# Altium schematic sheet LiDAR_Schematic.SchDoc
size A4; SheetNumber: 1; SheetTotal: 1
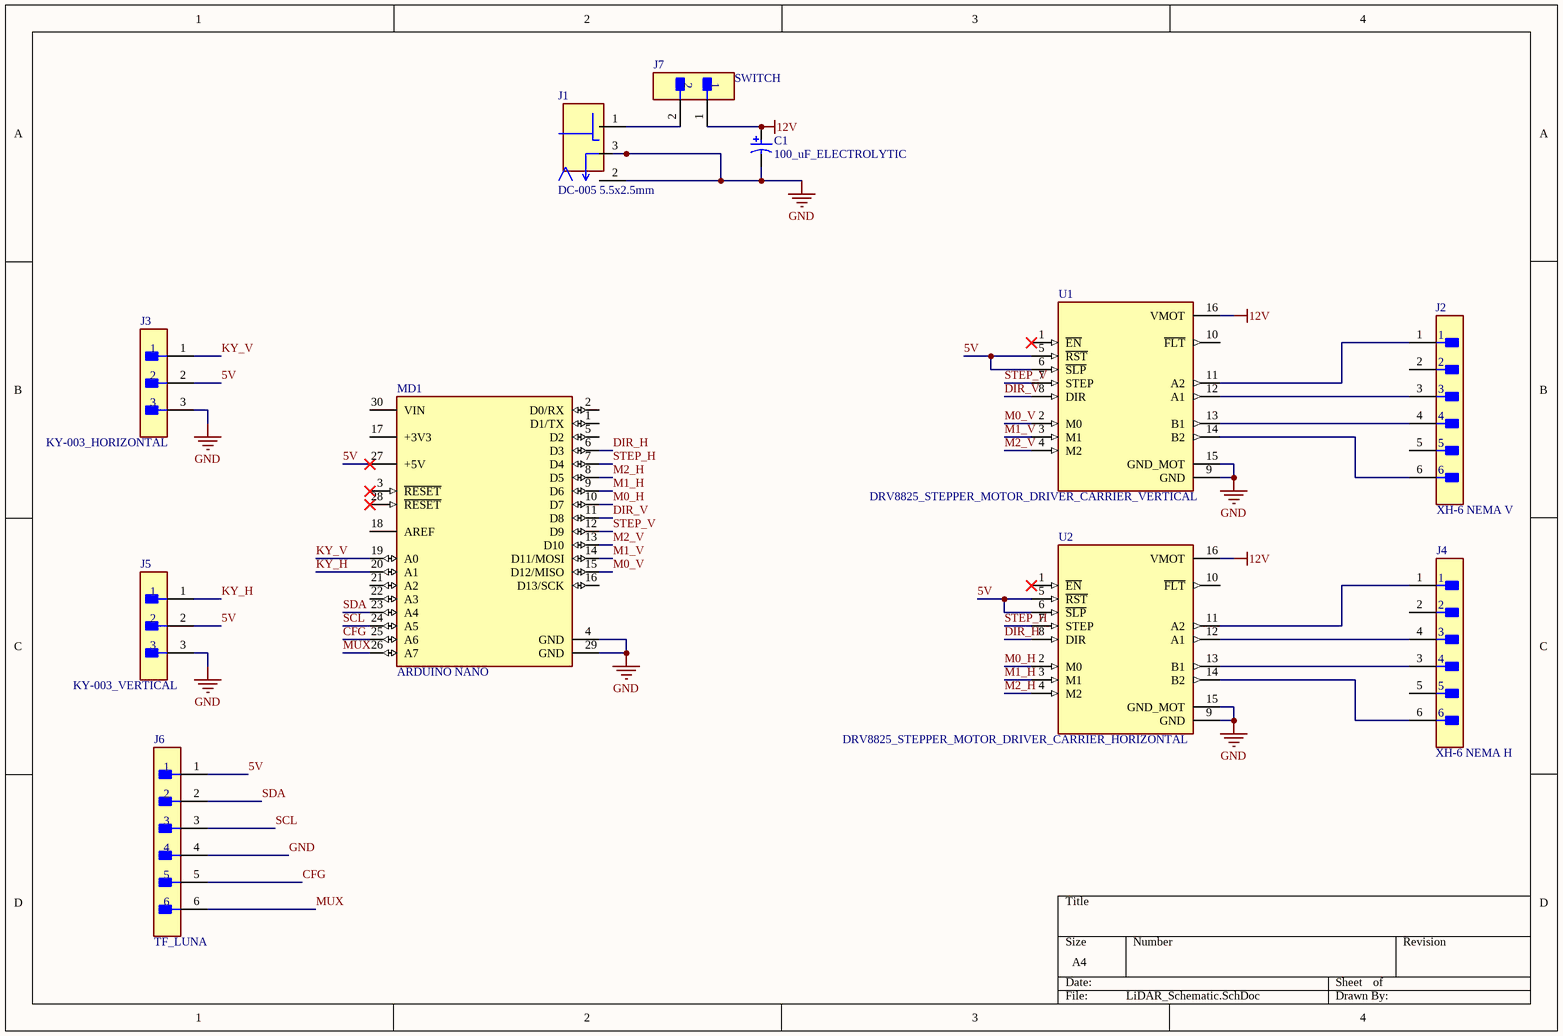
[diagram p0: LiDAR_Schematic.SchDoc]

## Parts
C1  100_uF_ELECTROLYTIC  [CAPPR55-250-1120X630X1220]
J1  DC-005 5.5x2.5mm  [GCT_DCJ250-10-A-XX-X_REVA]
J2  XH-6 NEMA V  [FP-B6B-XH-A_LF_SN-MFG]
J3  KY-003_HORIZONTAL  [FP-87224-3-MFG]
J4  XH-6 NEMA H  [FP-B6B-XH-A_LF_SN-MFG]
J5  KY-003_VERTICAL  [FP-87224-3-MFG]
J6  TF_LUNA  [FP-22-28-4060-MFG]
J7  SWITCH  [FP-TSW-102-07-S-S-MFG]
MD1  ARDUINO NANO  [FP-A000005-MFG]
U1  DRV8825_STEPPER_MOTOR_DRIVER_CARRIER_VERTICAL  [IC_DRV8825_STEPPER_MOTOR_DRIVER_CARRIER]
U2  DRV8825_STEPPER_MOTOR_DRIVER_CARRIER_HORIZONTAL  [IC_DRV8825_STEPPER_MOTOR_DRIVER_CARRIER]

## Nets
12V: C1.1 J7.1 U1.16(VMOT) U2.16(VMOT)
GND: C1.2 J1.2(TIP) J1.3(SHUNT) J3.3 J5.3 J6.4 MD1.4(GND) MD1.29(GND) U1.9(GND) U1.15(GND_MOT) U2.9(GND) U2.15(GND_MOT)
5V: J3.2 J5.2 J6.1 MD1.27(+5V) U1.5(~{RST}) U1.6(~{SLP}) U2.5(~{RST}) U2.6(~{SLP})
CFG: J6.5 MD1.25(A6)
DIR_H: MD1.6(D3) U2.8(DIR)
DIR_V: MD1.11(D8) U1.8(DIR)
KY_H: J5.1 MD1.20(A1)
KY_V: J3.1 MD1.19(A0)
M0_H: MD1.10(D7) U2.2(M0)
M0_V: MD1.15(D12/MISO) U1.2(M0)
M1_H: MD1.9(D6) U2.3(M1)
M1_V: MD1.14(D11/MOSI) U1.3(M1)
M2_H: MD1.8(D5) U2.4(M2)
M2_V: MD1.13(D10) U1.4(M2)
MUX: J6.6 MD1.26(A7)
SCL: J6.3 MD1.24(A5)
SDA: J6.2 MD1.23(A4)
STEP_H: MD1.7(D4) U2.7(STEP)
STEP_V: MD1.12(D9) U1.7(STEP)
NetJ1_1: J1.1(CENTER) J7.2
NetJ2_1: J2.1 U1.11(A2)
NetJ2_3: J2.3 U1.12(A1)
NetJ2_4: J2.4 U1.13(B1)
NetJ2_6: J2.6 U1.14(B2)
NetJ4_1: J4.1 U2.11(A2)
NetJ4_3: J4.3 U2.13(B1)
NetJ4_4: J4.4 U2.12(A1)
NetJ4_6: J4.6 U2.14(B2)

Not connected (* = marked no-connect by the designer): J2 2 5; J4 2 5; MD1 1(D1/TX) 2(D0/RX) 3(~{RESET})* 5(D2) 16(D13/SCK) 17(+3V3) 18(AREF) 21(A2) 22(A3) 28(~{RESET})* 30(VIN); U1 1(~{EN})* 10(~{FLT}); U2 1(~{EN})* 10(~{FLT})

## Library data of the parts
C1 = CMP-1665-00015-4: Aluminum Electrolytic Capacitor (Radial Lead Type), 100 uF, 35 V, -40 to 85 degC, 2-Pin THD, RoHS, Bulk; Manufacturer: Panasonic; Voltage Rating: 35 V; PackageReference: Radial; ComponentLink2URL: http://industrial.panasonic.com/cdbs/www-data/pdf/RDF0000/ABA0000C1047.pdf; DatasheetVersion: 03/2016; REACH SVHC: No SVHC; Mounting Technology: Through Hole; ComponentLink2Description: Datasheet; Packaging: Bulk; Lead Pitch: 2.5 mm; Height: 11.2 mm; Pins: 2; RoHSCompliant: true; Mount: Through Hole; Package Quantity: 200; Min Operating Temperature: -40 degC; Max Operating Temperature: 85 degC; PackageDescription: 2-Pin Through Hole Device, Dia 6.3 mm, Body Length 11.2 mm; ComponentLink1Description: Manufacturer URL; Length: 11.2 mm; ComponentLink1URL: http://www.panasonic.com/
J1 = DCJ250-10-A-XX-X_REVA: Power Barrel Connector Jack 2.55mm ID (0.100), 5.50mm OD (0.217) Through Hole, Right Angle; MP: DCJ250-10-A-K1-K; MF: Global Connector Technology; Package: None; Check_prices: https://www.snapeda.com/parts/DCJ250-10-A-K1-K/Global+Connector+Technology/view-part/?ref=eda; Purchase-URL: https://pricing.snapeda.com/search/part/DCJ250-10-A-K1-K/?ref=eda; Value: *; Availability: In Stock; Price: None; SnapEDA_Link: https://www.snapeda.com/parts/DCJ250-10-A-K1-K/Global+Connector+Technology/view-part/?ref=snap
J2 J4 = CMP-17439-000076-1: CONN HEADER VERT 6POS 2.5MM
J3 = CMP-2000-05697-2: CONN HEADER VERT 3POS 2.54MM; Number of Positions: 3; Gasket: No (Without); High Speed Serial Data Connector: No; Current Rating: 3A; Contact Post Length: 0.125inch; PCB Thickness: 1.397mm; PCB Mount Retention: Without; Connector Type: Plug; Approvals: CSA; PCB Mounting Orientation: Vertical; Pitch: 2.54mm; Mating Alignment: No (Without); Housing Color: Black; Contact Gender: Male; Length: 7.21mm; Max Operating Temperature: 105°C; Strain Relief: No (Without); Contact Material: Bronze; Row Spacing: 2.54mm; Series: AMPMODU MOD II; Board Standoff: No (Without); Package Quantity: 520; Radiation Hardening: No; Contact Protection: No (Without); Stabilizers: No (Without); Number of Rows: 1; Contact Mating Length: 8.08mm; Contact Shape: Square; Depth: 2.54mm; Contact Current Rating: 3A; Flammability Rating: UL94 V-0; Packaging: Carton; Number of Contacts: 3; Orientation: Straight; Mount: Through Hole; Keyed: No; Contact Type: Male Pin; Housing Material: Thermoplastic; High Temperature Housing: No; ELV: Compliant; Contact Plating: Gold; Termination: Through Hole; Selectively Loaded: No (Without); Lead Free: Lead Free; Min Operating Temperature: -65°C; Mating Connector Lock: No (Without); Color: Black; RoHS Compliant: Yes
J5 = CMP-2000-05697-2: CONN HEADER VERT 3POS 2.54MM; Number of Positions: 3; Gasket: No (Without); High Speed Serial Data Connector: No; Current Rating: 3A; Contact Post Length: 0.125inch; PCB Thickness: 1.397mm; PCB Mount Retention: Without; Connector Type: Plug; Approvals: CSA; Pitch: 2.54mm; Mating Alignment: No (Without); Housing Color: Black; Contact Gender: Male; Length: 7.21mm; Max Operating Temperature: 105°C; Strain Relief: No (Without); Contact Material: Bronze; Row Spacing: 2.54mm; Series: AMPMODU MOD II; Board Standoff: No (Without); Package Quantity: 520; Radiation Hardening: No; Contact Protection: No (Without); Stabilizers: No (Without); Number of Rows: 1; Contact Mating Length: 8.08mm; Contact Shape: Square; Depth: 2.54mm; Contact Current Rating: 3A; Flammability Rating: UL94 V-0; Packaging: Carton; Number of Contacts: 3; Orientation: Straight; Mount: Through Hole; Keyed: No; Contact Type: Male Pin; Housing Material: Thermoplastic; High Temperature Housing: No; ELV: Compliant; Contact Plating: Gold; Termination: Through Hole; Selectively Loaded: No (Without); Lead Free: Lead Free; Min Operating Temperature: -65°C; Mating Connector Lock: No (Without); Color: Black; RoHS Compliant: Yes; PCB Mounting Orientation: Vertical
J6 = CMP-04776-000763-1: CONN HEADER VERT 6POS 2.54MM; Voltage Rating: 250V; Current Rating: 4A; Number of Contacts: 6; Max Voltage Rating (DC): 250.25kV; Gender: Male; Contact Resistance: 20mR; Connector Type: Male Pin; Color: Black; Max Voltage Rating (AC): 250V; Pitch: 2.54mm; Orientation: Straight; Max Operating Temperature: 75°C; Contact Plating: Tin; Depth: 2.49mm; Contact Type: Male Pin; Number of Positions: 6; Length: 15.24mm; Packaging: Bulk; Mount: Through Hole; Housing Material: Thermoplastic; Housing Color: Black; Termination: Solder; Contact Material: Brass; Min Operating Temperature: 0°C; Series: KK® 42375; Number of Rows: 1; Package Quantity: 1; RoHS Compliant: Yes; Contact Mating Length: 0.24inch
J7 = CMP-1681-00004-5: CONN HEADER VERT 2POS 2.54MM; Number of Positions: 2; Max Voltage Rating (AC): 550V; Max Current Rating: 7.6A; Gender: Male; Contact Type: Male Pin; REACH SVHC: No SVHC; Connector Type: Header; Number of Rows: 1; Flammability Rating: UL94 V-0; Pitch: 2.54mm; Orientation: Straight; Termination: Solder; Insulation Material: PBT; RoHS Compliant: Yes; Housing Color: Black; Mount: Through Hole; Contact Mating Length: 0.23inch; Contact Shape: Square; Contact Material: Bronze; Min Operating Temperature: -55°C; Number of Contacts: 2; Depth: 2.54mm; Housing Material: Polyester; Packaging: Bulk; Length: 5.08mm; Radiation Hardening: No; Insulation Color: Black; Series: TSW; Color: Black; Max Operating Temperature: 125°C; Package Quantity: 1; Fastening Type: Pull; Contact Plating: Gold; Lead Free: Lead Free; Contact Finish - Mating: GOLD; Width: 2.54mm
MD1 = CMP-189986-000002-1: ARDUINO NANO ATMEGA328 EVAL BRD; Number of Bits: 8; Evaluation Kit: Yes; Operating Supply Voltage: 12V; Interface: I2C; Data Bus Width: 8b; Core Architecture: AVR; Packaging: Bulk; Length: 7inch; Package Quantity: 50; Width: 5inch; REACH SVHC: No SVHC; Weight: 0.358383oz; Series: AVR® ATmega; Height: 0.25inch
U1 U2 = DRV8825_STEPPER_MOTOR_DRIVER_CARRIER: Stepper motor controler; IC: DRV8825; 1.5A; Uin mot: 8.2Ã·45V; Availability: Unavailable; MP: DRV8825_STEPPER_MOTOR_DRIVER_CARRIER; Value: *; Price: None; Package: None